# EAGLE design busmon (EAGLE 9.4.2)
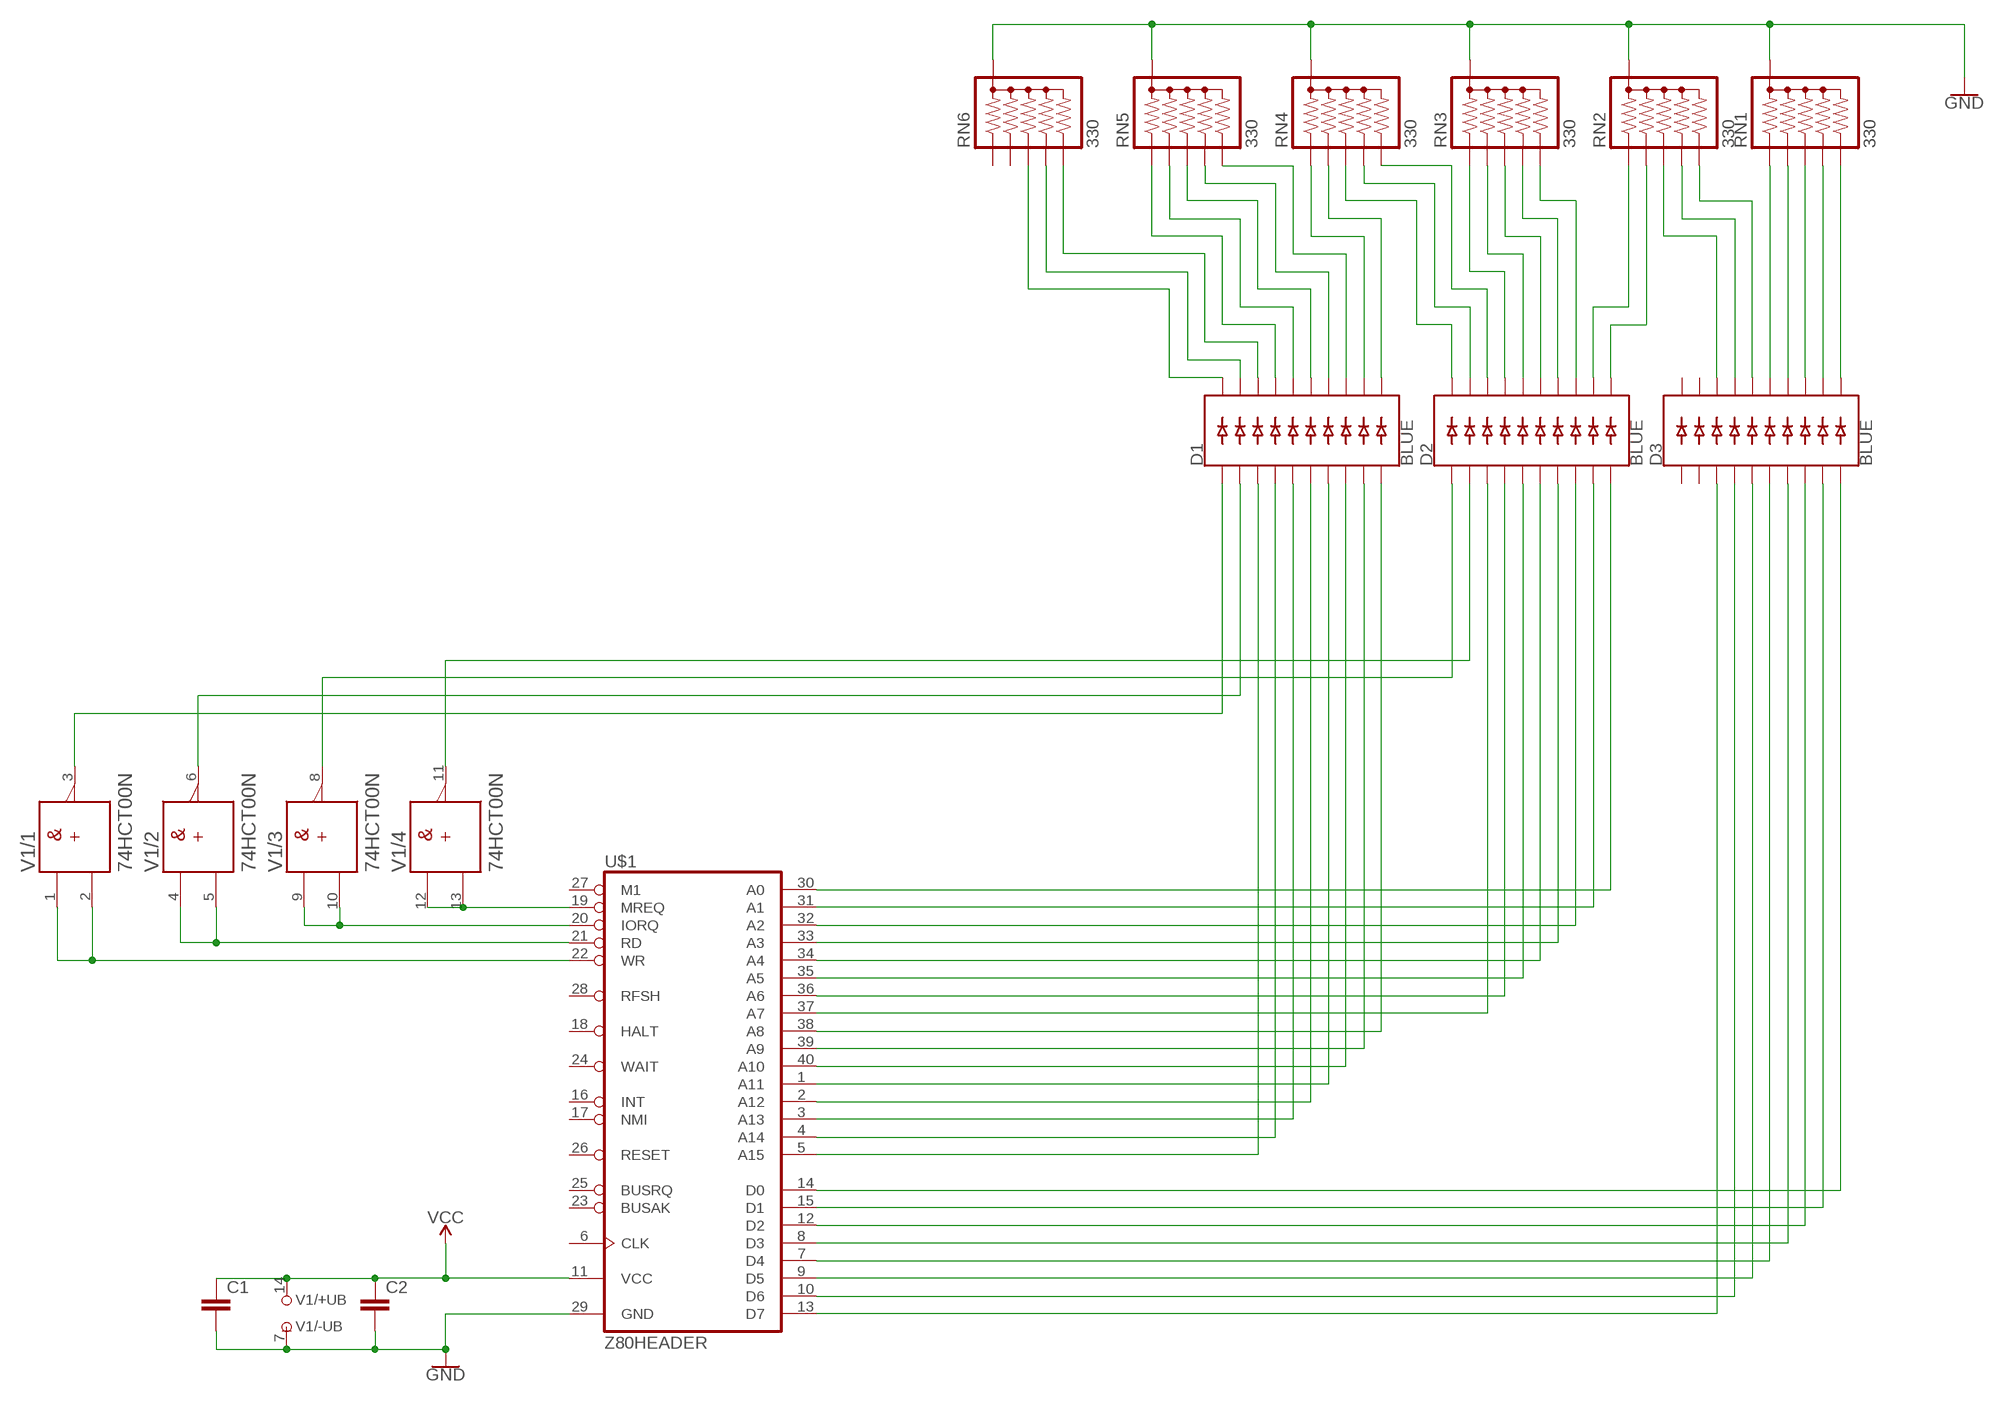
[diagram p0: schematic, sheet 1]

## Parts
C1  C2,5-3  [C2.5-3]
C2  C2,5-3  [C2.5-3]
D1  BLUE  LED_BARGRAPH_10BLUE  [LED_BARGRAPH_10]
D2  BLUE  LED_BARGRAPH_10BLUE  [LED_BARGRAPH_10]
D3  BLUE  LED_BARGRAPH_10BLUE  [LED_BARGRAPH_10]
RN1  330  330_BUSSED_5  [RPACK-SIP-PTH-5]
RN2  330  330_BUSSED_5  [RPACK-SIP-PTH-5]
RN3  330  330_BUSSED_5  [RPACK-SIP-PTH-5]
RN4  330  330_BUSSED_5  [RPACK-SIP-PTH-5]
RN5  330  330_BUSSED_5  [RPACK-SIP-PTH-5]
RN6  330  330_BUSSED_5  [RPACK-SIP-PTH-5]
U$1  Z80HEADER  [2X20]
V1  74HCT00N  [DIL14]

## Nets
GND: C1.2 C2.2 RN1.P$1 RN2.P$1 RN3.P$1 RN4.P$1 RN5.P$1 RN6.P$1 U$1.29(GND) V1.7(/-UB:-UB)
N$1: D2.2(A1) V1.11(/4:Y)
N$2: D2.1(A) V1.8(/3:Y)
N$3: D1.2(A1) V1.6(/2:Y)
N$4: D2.10(A9) U$1.30(A0)
N$5: D1.1(A) V1.3(/1:Y)
N$6: D2.9(A8) U$1.31(A1)
N$7: D2.8(A7) U$1.32(A2)
N$8: D2.7(A6) U$1.33(A3)
N$9: D2.6(A5) U$1.34(A4)
N$10: D2.5(A4) U$1.35(A5)
N$11: D2.4(A3) U$1.36(A6)
N$12: D2.3(A2) U$1.37(A7)
N$14: D1.10(A9) U$1.38(A8)
N$15: D1.9(A8) U$1.39(A9)
N$16: D1.8(A7) U$1.40(A10)
N$17: D3.10(A9) U$1.14(D0)
N$18: D3.9(A8) U$1.15(D1)
N$19: D3.8(A7) U$1.12(D2)
N$20: D3.7(A6) U$1.8(D3)
N$21: D3.6(A5) U$1.7(D4)
N$22: D3.5(A4) U$1.9(D5)
N$23: D3.4(A3) U$1.10(D6)
N$24: D3.3(A2) U$1.13(D7)
N$25: U$1.19(MREQ) V1.12(/4:A) V1.13(/4:B)
N$26: D2.19(C1) RN4.P$5
N$27: U$1.20(IORQ) V1.9(/3:A) V1.10(/3:B)
N$28: U$1.21(RD) V1.4(/2:A) V1.5(/2:B)
N$29: U$1.22(WR) V1.1(/1:A) V1.2(/1:B)
N$30: D3.11(C9) RN1.P$6
N$31: D3.12(C8) RN1.P$5
N$32: D3.13(C7) RN1.P$4
N$33: D3.14(C6) RN1.P$3
N$34: D3.15(C5) RN1.P$2
N$35: D3.16(C4) RN2.P$6
N$36: D3.17(C3) RN2.P$5
N$37: D3.18(C2) RN2.P$4
N$38: D2.11(C9) RN2.P$3
N$39: D2.12(C8) RN2.P$2
N$40: D2.13(C7) RN3.P$6
N$41: D2.14(C6) RN3.P$5
N$42: D2.15(C5) RN3.P$4
N$43: D2.16(C4) RN3.P$3
N$44: D2.17(C3) RN3.P$2
N$45: D2.18(C2) RN4.P$6
N$46: D2.20(C) RN4.P$4
N$47: D1.11(C9) RN4.P$3
N$48: D1.17(C3) RN5.P$2
N$49: D1.12(C8) RN4.P$2
N$50: D1.13(C7) RN5.P$6
N$51: D1.18(C2) RN6.P$6
N$52: D1.14(C6) RN5.P$5
N$53: D1.7(A6) U$1.1(A11)
N$54: D1.15(C5) RN5.P$4
N$55: D1.16(C4) RN5.P$3
N$56: D1.6(A5) U$1.2(A12)
N$57: D1.19(C1) RN6.P$5
N$58: D1.20(C) RN6.P$4
N$59: D1.5(A4) U$1.3(A13)
N$60: D1.4(A3) U$1.4(A14)
N$61: D1.3(A2) U$1.5(A15)
VCC: C1.1 C2.1 U$1.11(VCC) V1.14(/+UB:+UB)
Unconnected: D3.1(A) D3.2(A1) D3.19(C1) D3.20(C) RN6.P$2 RN6.P$3 U$1.6(CLK) U$1.16(INT) U$1.17(NMI) U$1.18(HALT) U$1.23(BUSAK) U$1.24(WAIT) U$1.25(BUSRQ) U$1.26(RESET) U$1.27(M1) U$1.28(RFSH)

## Library data of the parts
C1 C2 = capacitor-wima:C: CAPACITOR naming: grid - package width
D1-D3 = SparkFun-LED:LED_BARGRAPH_10: Young Sun LED Tech - YSLB-10251G5-10 10-Segment LED Bar Graph Features: Red Vf = 2.1V, Ifmax = 20mA Yellow Vf = 2.1V, Ifmax = 20mA Blue Vf = 3.4V, Ifmax = 20mA Green Vf = 3.4V, Ifmax = 20mA SparkFun Products: Red <https://www.sparkfun.com/products/9935> Yellow <https://www.sparkfun.com/products/9936> Green <https://www.sparkfun.com/products/9938> Blue <https://www.sparkfun.com/products/9937>; PROD_ID: DIO-10613
RN1-RN6 = SparkFun-Resistors:330_BUSSED_5: 5 x 330Ω resistor network A resistor is a passive two-terminal electrical component that implements electrical resistance as a circuit element. Resistors act to reduce current flow, and, at the same time, act to lower voltage levels within circuits. - Wikipedia This is a bussed or ladder network.; SF_SKU: COM-10856
U$1 = wntrmute:Z80
V1 = 74ttl-din:74*00: Quad 2-input NAND gate

## Net classes
0 default: width 0.152 mm, drill 0.254 mm, clearance 0.152 mm

## Board
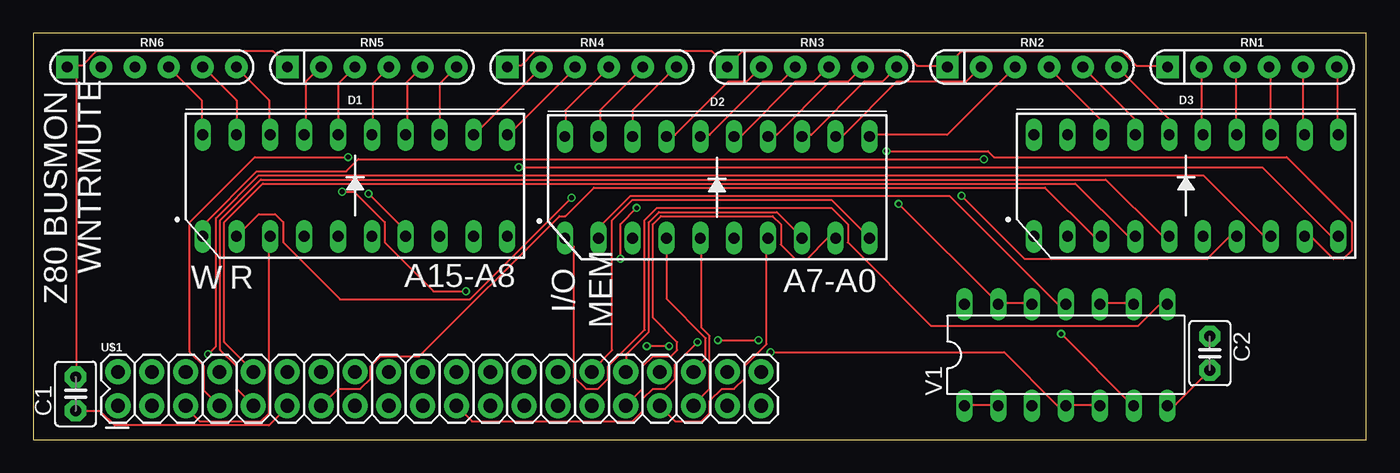
[diagram p1: board, top side]
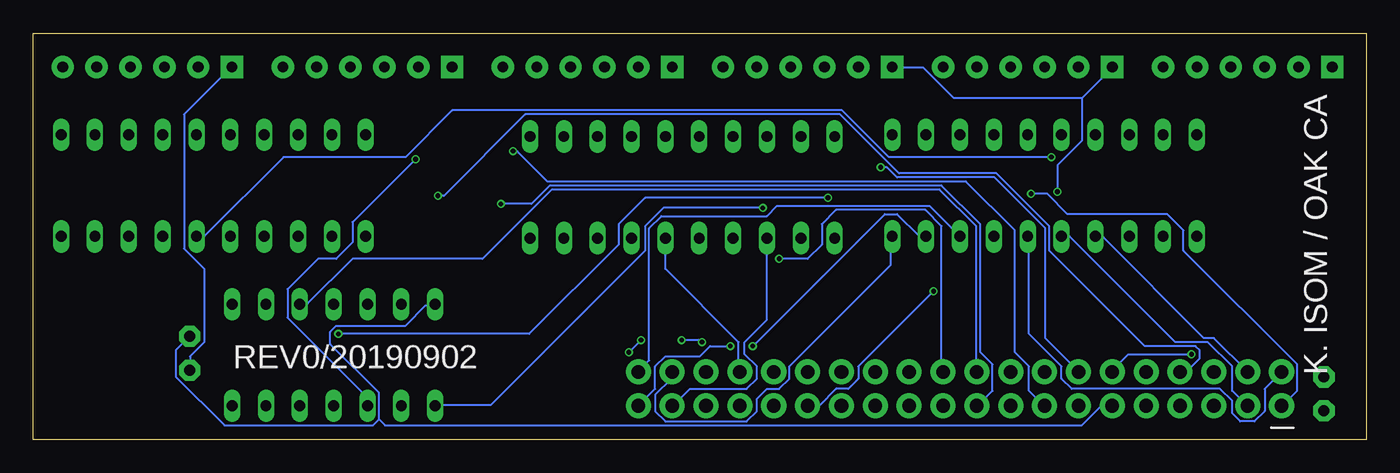
[diagram p2: board, bottom side, seen from below]

Size 100 x 30.47 mm. Coordinates in mm from the lower left corner, seen from the top.
Outline: 0,0 100,0 100,30.47 0,30.47 0,0
Copper layers (1*16): Top 0.035559375mm / dielectric 1.6mm / Bottom 0.035559375mm
Design rules "oshpark-2layer": minimum track width 6mil, minimum drill 10mil, track to track 6mil, track to pad 6mil, pad to pad 6mil, via to via 6mil, smd to smd 6mil, copper to edge 15mil, drill to drill 6mil, minimum pad ring 5mil, minimum via ring 5mil, stop-mask expansion 2.5mil, vias tented up to drill 0mil, thermal gap 10mil

### Footprints (pad centres in the part's own frame; a part is rotated, then mirrored left to right if it is on the bottom)
C2.5-3 = drill 0.813 pad 1.6 octagon: 1 -1.27,0; 2 1.27,0
LED_BARGRAPH_10 = drill 0.813 long: 1 -11.43,-3.81; 2 -8.89,-3.81; 3 -6.35,-3.81; 4 -3.81,-3.81; 5 -1.27,-3.81; 6 1.27,-3.81; 7 3.81,-3.81; 8 6.35,-3.81; 9 8.89,-3.81; 10 11.43,-3.81; 11 11.43,3.81; 12 8.89,3.81; 13 6.35,3.81; 14 3.81,3.81; 15 1.27,3.81; 16 -1.27,3.81; 17 -3.81,3.81; 18 -6.35,3.81; 19 -8.89,3.81; 20 -11.43,3.81
RPACK-SIP-PTH-5 = drill 0.8 pad 1.676 square: P$1 0,0 | drill 0.8 pad 1.676: P$2 0,-2.54; P$3 0,-5.08; P$4 0,-7.62; P$5 0,-10.16; P$6 0,-12.7
2X20 = drill 1.016 pad 1.88: 1 0,0; 2 0,2.54; 3 2.54,0; 4 2.54,2.54; 5 5.08,0; 6 5.08,2.54; 7 7.62,0; 8 7.62,2.54; 9 10.16,0; 10 10.16,2.54; 11 12.7,0; 12 12.7,2.54; 13 15.24,0; 14 15.24,2.54; 15 17.78,0; 16 17.78,2.54; 17 20.32,0; 18 20.32,2.54; 19 22.86,0; 20 22.86,2.54; 21 25.4,0; 22 25.4,2.54; 23 27.94,0; 24 27.94,2.54; 25 30.48,0; 26 30.48,2.54; 27 33.02,0; 28 33.02,2.54; 29 35.56,0; 30 35.56,2.54; 31 38.1,0; 32 38.1,2.54; 33 40.64,0; 34 40.64,2.54; 35 43.18,0; 36 43.18,2.54; 37 45.72,0; 38 45.72,2.54; 39 48.26,0; 40 48.26,2.54
DIL14 = drill 0.813 long: 1 -7.62,-3.81; 2 -5.08,-3.81; 3 -2.54,-3.81; 4 0,-3.81; 5 2.54,-3.81; 6 5.08,-3.81; 7 7.62,-3.81; 8 7.62,3.81; 9 5.08,3.81; 10 2.54,3.81; 11 0,3.81; 12 -2.54,3.81; 13 -5.08,3.81; 14 -7.62,3.81

### Placement (x,y rotation side)
C1  3.17,3.43 90 top
C2  88.27,6.48 270 top
D1  24.13,19.05 0 top
D2  51.31,18.92 0 top
D3  86.49,19.05 0 top
RN1  85.09,27.94 90 top
RN2  68.58,27.94 90 top
RN3  52.07,27.94 90 top
RN4  35.56,27.94 90 top
RN5  19.05,27.94 90 top
RN6  2.54,27.94 90 top
U$1  6.35,2.54 0 top
V1  77.47,6.35 0 top

### Tracks (layer width: path | path; a pad name or v marks a point on that pad's centre or on a via)
GND  (via drill 0.35)
  Top 0.152: RN4.P$1 35.66,28.04 36.58,28.04 37.64,29.11 50.9,29.11 RN3.P$1 52.12,28.04 53.19,29.11 65.23,29.11 66.29,28.04 68.58,28.04 | 68.58,28.04 69.65,29.11 81.69,29.11 82.75,28.04 85.04,28.04 RN1.P$1 | 68.58,28.04 RN2.P$1 | 3.2,28.04 3.66,28.04 4.72,29.11 17.98,29.11 19.05,28.04 RN5.P$1 | 3.2,28.04 2.59,28.04 RN6.P$1 3.2,28.04 | v32.46,11.12 30.02,11.12 26.36,14.78 26.36,16.31 24.08,18.59 v23.16,18.59 | C2.2 85.65,2.59 85.19,2.59 V1.7 | 3.2,28.04 3.2,4.72 C1.2
  Bottom 0.152: v32.46,11.12 38.1,5.49 38.1,4.57 38.86,3.81 39.78,3.81 41,2.59 41.91,2.59 U$1.29 | v23.16,18.59 23.16,20.57 21.34,22.4 21.34,25.6 | 21.34,25.6 19.05,27.89 RN5.P$1 | 21.34,25.6 30.94,25.6 33.22,27.89 35.51,27.89 RN4.P$1 | C2.2 88.24,5.33 88.24,6.25 87.17,7.32 87.17,12.8 88.7,14.33 88.7,24.38 85.19,27.89 RN1.P$1
N$1
  Top 0.152: V1.11 77.42,10.21 76.81,10.21 68.73,18.29 44.81,18.29 42.52,16 42.52,15.24 D2.2
N$2
  Top 0.152: V1.8 85.04,10.06 84.43,10.06 82.91,8.53 67.36,8.53 61.11,14.78 61.11,16.15 59.89,17.37 46.79,17.37 45.87,16.46 45.87,8.23 43.13,5.49 43.13,4.57 42.37,3.81 41.45,3.81 40.54,4.72 40.54,14.48 39.93,15.09 D2.1
N$3  (via drill 0.35)
  Top 0.152: v77.11,7.92 82.45,2.59 V1.6 | v40.39,18.14 32.77,10.52 23.01,10.52 18.75,14.78 18.75,16.31 18.14,16.92 16.92,16.92 D1.2
  Bottom 0.152: v77.11,7.92 62.79,7.92 56.08,14.63 56.08,16.15 54.1,18.14 v40.39,18.14
N$4
  Top 0.152: D2.10 62.64,15.24 59.89,17.98 44.96,17.98 43.43,16.46 43.43,6.71 41.91,5.18 U$1.30
N$5  (via drill 0.35)
  Top 0.152: v71.32,21.03 24.38,21.03 23.47,20.12 16.76,20.12 12.8,16.15 12.8,15.24 D1.1
  Bottom 0.152: v71.32,21.03 76.05,16.31 76.05,14.78 77.27,13.56 78.64,13.56 80.92,11.28 80.92,9.14 74.98,3.2 74.98,2.59 V1.3
N$6
  Top 0.152: U$1.31 45.72,3.81 45.72,5.49 46.48,6.25 47.85,6.25 48.31,6.71 48.31,7.32 46.48,9.14 46.48,16.15 47.09,16.76 55.47,16.76 56.08,16.15 56.08,14.63 57.15,13.56 58.06,13.56 59.59,15.09 60.2,15.09 D2.9
N$7
  Top 0.152: D2.8 57.61,15.24 55.78,17.07 46.94,17.07 46.18,16.31 46.18,8.08 44.5,6.4 44.5,5.18 U$1.32
N$8
  Top 0.152: U$1.33 48.16,1.37 50.14,1.37 50.75,1.98 50.75,2.9 51.66,3.81 52.58,3.81 53.34,4.57 53.34,5.49 55.02,7.16 55.02,15.09 D2.7
N$9
  Bottom 0.152: D2.6 52.58,12.8 47.09,7.32 47.09,5.18 U$1.34
N$10
  Top 0.152: D2.5 50.14,15.09 50.14,8.38 50.75,7.77 50.75,3.81 49.53,2.59 U$1.35
N$11
  Top 0.152: D2.4 47.55,15.09 47.55,10.52 50.44,7.62 50.44,6.1 49.53,5.18 U$1.36
N$12
  Bottom 0.152: D2.3 44.96,8.99 46.63,7.32 46.63,6.4 45.72,5.49 45.72,4.57 46.48,3.81 50.75,3.81 51.97,2.59 U$1.37
N$14
  Bottom 0.152: D1.10 35.66,15.24 35.66,13.11 43.28,5.49 43.28,4.57 44.04,3.81 44.96,3.81 45.72,3.05 45.72,2.13 46.48,1.37 52.58,1.37 53.34,2.13 53.34,3.35 52.12,4.57 52.12,5.03 U$1.38
N$15  (via drill 0.35)
  Top 0.152: v47.7,7.01 v46.02,7.01
  Bottom 0.152: D1.9 33.53,15.24 35.2,16.92 36.12,16.92 v46.02,7.01 | v47.7,7.01 49.23,7.01 49.99,6.25 52.58,6.25 53.34,5.49 53.34,3.81 U$1.39
N$16
  Bottom 0.152: D1.8 32.77,17.53 44.2,17.53 44.96,16.76 52.88,16.76 53.8,15.85 53.8,5.94 54.56,5.18 U$1.40
N$17  (via drill 0.35)
  Top 0.152: D3.10 97.38,15.24 92.2,20.42 v36.42,20.42
  Bottom 0.152: v36.42,20.42 35.97,20.42 35.2,19.66 27.89,19.66 24.08,15.85 24.08,7.62 21.64,5.18 U$1.14
N$18  (via drill 0.35)
  Top 0.152: D3.9 95.86,15.24 97.54,13.56 98.3,13.56 98.91,14.17 98.91,16.31 94.03,21.18 72.08,21.18 71.63,21.64 v64.01,21.64
  Bottom 0.152: v64.01,21.64 63.7,21.64 61.42,19.36 30.02,19.36 26.36,15.7 26.36,6.55 25.3,5.49 25.3,3.66 24.23,2.59 U$1.15
N$19  (via drill 0.35)
  Top 0.152: D3.8 92.35,15.24 87.78,19.81 16.92,19.81 13.72,16.61 13.72,7.01 v13.11,6.4
  Bottom 0.152: v13.11,6.4 17.83,6.4 19.05,5.18 U$1.12
N$20  (via drill 0.35)
  Top 0.152: D3.7 89.76,15.24 88.09,13.56 74.37,13.56 v69.65,18.29
  Bottom 0.152: v69.65,18.29 69.19,18.29 63.09,24.38 39.47,24.38 35.05,19.96 27.74,19.96 23.77,16 23.77,14.17 16.61,7.01 12.8,7.01 12.5,6.71 12.5,6.1 13.41,5.18 13.87,5.18 U$1.8
N$21  (via drill 0.35)
  Top 0.152: v23.62,21.18 16.61,21.18 11.73,16.31 11.73,6.55 12.8,5.49 12.8,3.66 13.87,2.59 U$1.7
  Bottom 0.152: D3.6 87.17,15.24 81.23,21.18 72.08,21.18 68.58,24.69 39.32,24.69 35.81,21.18 v23.62,21.18
N$22
  Top 0.152: D3.5 84.73,15.24 80.47,19.51 17.07,19.51 14.02,16.46 14.02,6.71 15.24,5.49 15.24,3.81 U$1.9
N$23
  Top 0.152: D3.4 82.14,15.24 78.18,19.2 17.22,19.2 14.33,16.31 14.33,7.32 16.46,5.18 U$1.10
N$24
  Top 0.152: D3.3 79.55,15.24 75.89,18.9 42.06,18.9 39.93,16.76 39.47,16.76 28.96,6.25 26.06,6.25 25.3,5.49 25.3,4.57 24.54,3.81 22.86,3.81 U$1.13
N$25  (via drill 0.35)
  Top 0.152: 72.39,10.21 74.83,10.21 V1.12 | v64.92,17.68 72.39,10.21 | 72.39,10.21 V1.13
  Bottom 0.152: v64.92,17.68 62.64,17.68 61.27,19.05 31.85,19.05 28.96,16.15 28.96,6.55 28.04,5.64 28.04,3.66 29.11,2.59 U$1.19
N$26
  Top 0.152: D2.19 42.52,22.86 42.52,24.69 45.72,27.89 RN4.P$5
N$27
  Top 0.152: V1.10 80.01,10.21 82.45,10.21 V1.9
  Bottom 0.152: V1.10 80.01,10.21 79.4,10.21 76.05,13.56 66.29,13.56 61.11,18.75 32,18.75 29.26,16 29.26,5.18 U$1.20
N$28  (via drill 0.35)
  Top 0.152: V1.5 80.01,2.59 77.57,2.59 V1.4 77.42,2.59 76.81,2.59 72.85,6.55 v55.32,6.55 | v51.36,7.47 v54.41,7.47 | v49.84,7.32 48.16,5.64 48.16,4.57 47.4,3.81 46.48,3.81 45.72,3.05 45.72,2.13 44.96,1.37 32.92,1.37 U$1.21
  Bottom 0.152: v54.41,7.47 v55.32,6.55 | v51.36,7.47 49.99,7.47 v49.84,7.32
N$29  (via drill 0.35)
  Top 0.152: V1.1 69.95,2.59 72.39,2.59 V1.2 | v45.26,17.37 44.04,16.15 v44.04,13.56
  Bottom 0.152: v45.26,17.37 52.73,17.37 54.1,16 54.1,14.17 65.68,2.59 69.8,2.59 V1.1 | v44.04,13.56 41.91,13.56 40.84,14.63 40.84,16.15 39.78,17.22 33.07,17.22 31.85,16 31.85,5.18 U$1.22
N$30
  Top 0.152: D3.11 97.84,22.86 97.84,27.89 RN1.P$6
N$31
  Top 0.152: RN1.P$5 95.25,22.86 D3.12
N$32
  Top 0.152: D3.13 92.81,22.86 92.81,27.89 RN1.P$4
N$33
  Top 0.152: D3.14 90.22,22.86 90.22,27.89 RN1.P$3
N$34
  Top 0.152: RN1.P$2 87.63,22.86 D3.15
N$35
  Top 0.152: D3.16 85.19,22.86 85.19,24.08 81.38,27.89 RN2.P$6
N$36
  Top 0.152: RN2.P$5 82.6,24.08 82.6,22.86 D3.17
N$37
  Top 0.152: D3.18 80.01,22.86 80.01,24.08 76.2,27.89 RN2.P$4
N$38
  Top 0.152: RN2.P$3 68.58,22.86 62.79,22.86 D2.11
N$39
  Top 0.152: D2.12 60.2,22.86 60.81,22.86 64.77,26.82 69.95,26.82 71.02,27.89 RN2.P$2
N$40
  Top 0.152: D2.13 57.76,22.86 58.37,22.86 62.33,26.82 63.7,26.82 64.77,27.89 RN3.P$6
N$41
  Top 0.152: RN3.P$5 61.11,26.82 59.74,26.82 55.78,22.86 55.17,22.86 D2.14
N$42
  Top 0.152: D2.15 52.58,22.86 53.19,22.86 57.15,26.82 58.52,26.82 59.59,27.89 RN3.P$4
N$43
  Top 0.152: D2.16 50.14,22.86 50.75,22.86 54.71,26.82 56.08,26.82 57.15,27.89 RN3.P$3
N$44
  Top 0.152: RN3.P$2 53.49,26.82 52.12,26.82 48.16,22.86 47.55,22.86 D2.17
N$45
  Top 0.152: D2.18 44.96,24.69 48.16,27.89 RN4.P$6
N$46
  Top 0.152: RN4.P$4 39.93,24.69 39.93,22.86 D2.20
N$47
  Top 0.152: D1.11 35.66,22.86 40.69,27.89 RN4.P$3
N$48
  Top 0.152: D1.17 20.42,22.86 20.42,26.82 21.49,27.89 RN5.P$2
N$49
  Top 0.152: D1.12 33.07,22.86 38.1,27.89 RN4.P$2
N$50
  Top 0.152: D1.13 30.48,26.67 RN5.P$6
N$51
  Top 0.152: D1.18 17.68,22.86 17.68,25.45 15.24,27.89 RN6.P$6
N$52
  Top 0.152: D1.14 28.04,22.86 28.04,26.82 29.11,27.89 RN5.P$5
N$53  (via drill 0.35)
  Top 0.152: v25.15,18.44 27.89,15.7 27.89,15.24 D1.7
  Bottom 0.152: v25.15,18.44 23.93,18.44 22.4,16.92 14.94,16.92 13.72,15.7 13.72,14.17 5.18,5.64 5.18,3.66 6.25,2.59 U$1.1
N$54
  Top 0.152: D1.15 25.45,22.86 25.45,26.67 26.67,27.89 RN5.P$4
N$55
  Top 0.152: D1.16 22.86,26.67 RN5.P$3
N$56
  Bottom 0.152: U$1.2 7.62,3.81 7.62,2.13 8.38,1.37 9.45,1.37 10.06,1.98 10.06,2.9 10.97,3.81 22.1,3.81 22.86,4.57 22.86,5.49 25.3,7.92 25.3,15.24 D1.6
N$57
  Top 0.152: D1.19 15.24,25.45 12.8,27.89 RN6.P$5
N$58
  Top 0.152: RN6.P$4 12.65,25.45 12.65,22.86 D1.20
N$59
  Bottom 0.152: D1.5 22.25,15.24 14.33,7.32 11.89,7.32 10.06,5.49 10.06,3.66 8.99,2.59 U$1.3
N$60
  Bottom 0.152: D1.4 19.81,15.24 12.19,7.62 11.43,7.62 U$1.4
N$61
  Top 0.152: D1.3 17.68,15.24 17.68,1.98 17.07,1.37 12.5,1.37 11.43,2.44 U$1.5
VCC
  Top 0.152: C1.1 3.2,2.13 5.03,2.13 6.1,1.07 17.68,1.07 19.05,2.44 U$1.11
  Bottom 0.152: 74.07,1.52 74.07,3.5 77.72,7.16 77.72,8.08 77.27,8.53 72.08,8.53 70.56,10.06 69.95,10.06 V1.14 | 74.07,1.52 74.52,1.07 85.65,1.07 89.31,4.72 89.31,6.71 C2.1 | 74.07,1.52 73.61,1.07 21.34,1.07 19.96,2.44 19.05,2.44 U$1.11

### Text on the board
tPlace: WNTRMUTE | W | R | A15-A8 | A7-A0 | Z80 BUSMON | I/O | MEM
bPlace: K. ISOM / OAK CA | REV0/20190902